# Altium schematic sheet TPSM846C23_template.SchDoc
size B; Organization: Altium Limited; Address1: L3, 12a Rodborough Rd; Address2: Frenchs Forest; Address3: NSW; Address4: Australia 2086
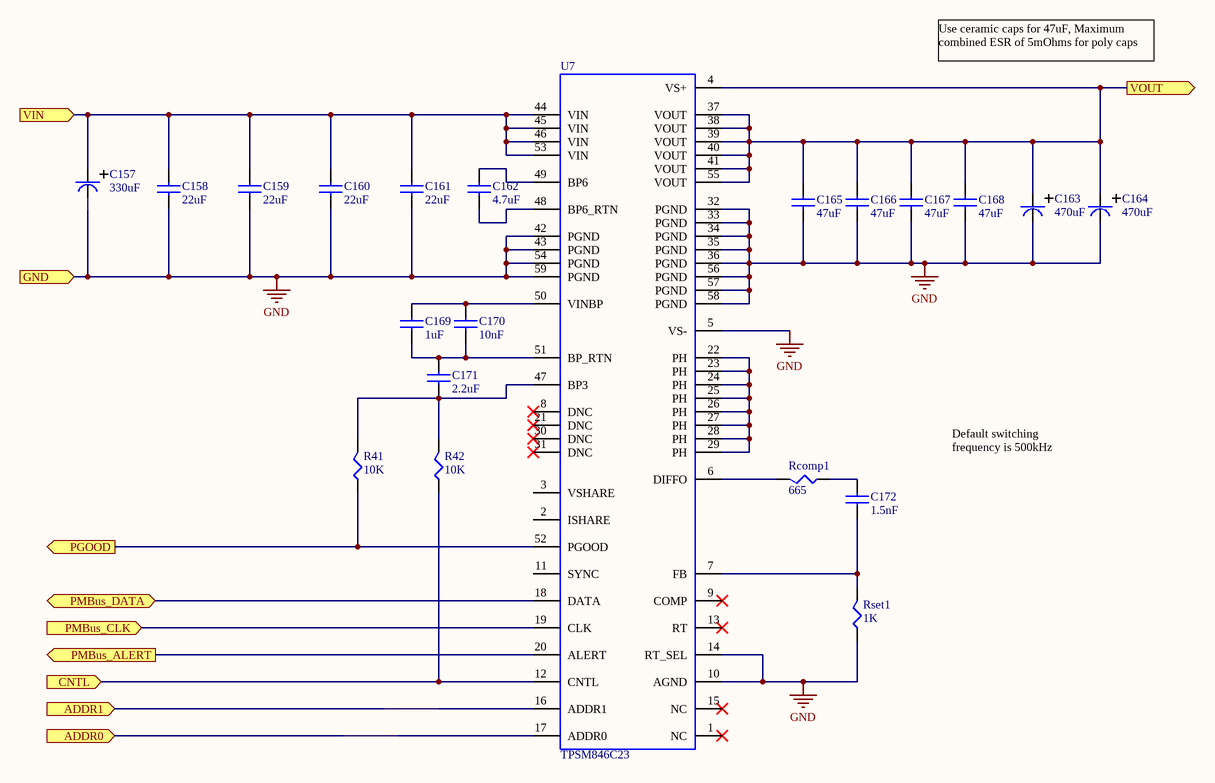
[diagram p0: TPSM846C23_template.SchDoc]

## Parts
C157  Capacitance: 330uF  [CAPAE110103X127M]  (hidden comment: CAP_POLY_330uF_25V)
C158  Capacitance: 22uF  [CAPC4532X28N]  (hidden comment: CAP_22uF_1812_25V)
C159  Capacitance: 22uF  [CAPC4532X28N]  (hidden comment: CAP_22uF_1812_25V)
C160  Capacitance: 22uF  [CAPC4532X28N]  (hidden comment: CAP_22uF_1812_25V)
C161  Capacitance: 22uF  [CAPC4532X28N]  (hidden comment: CAP_22uF_1812_25V)
C162  Capacitance: 4.7uF  [CAPC2012X14N]  (hidden comment: CAP_4.7uF_0805_25V)
C163  Capacitance: 470uF  [CAPAE110103X127M]  (hidden comment: CAP_POLY_470uF_16V)
C164  Capacitance: 470uF  [CAPAE110103X127M]  (hidden comment: CAP_POLY_470uF_16V)
C165  Capacitance: 47uF  [CAPC2012X14N]  (hidden comment: CAP_47uF_0805_10V)
C166  Capacitance: 47uF  [CAPC2012X14N]  (hidden comment: CAP_47uF_0805_10V)
C167  Capacitance: 47uF  [CAPC2012X14N]  (hidden comment: CAP_47uF_0805_10V)
C168  Capacitance: 47uF  [CAPC2012X14N]  (hidden comment: CAP_47uF_0805_10V)
C169  Capacitance: 1uF  [CAPC2012X14N]  (hidden comment: CAP_1uF_0805_25V)
C170  Capacitance: 10nF  [CAPC1005X06N]  (hidden comment: CAP_10nF_0402_25V)
C171  Capacitance: 2.2uF  [CAPC1005X06N]  (hidden comment: CAP_2.2uF_0402_25V)
C172  Capacitance: 1.5nF  [CAPC0603X02N]  (hidden comment: CAP_1500pF_0201_25V)
R41  Resistance: 10K  [RESC1608X06N]  (hidden comment: RES_10K_0603)
R42  Resistance: 10K  [RESC1608X06N]  (hidden comment: RES_10K_0603)
Rcomp1  Resistance: 665  [RESC1608X06N]  (hidden comment: RES_665_0603)
Rset1  Resistance: 1K  [RESC1608X06N]  (hidden comment: RES_1K_0603)
U7  TPSM846C23  [QFM-59]

## Ports
ADDR0 (in), ADDR1 (in), CNTL (in), GND (in), PGOOD (out), PMBus_ALERT (out), PMBus_CLK (in), PMBus_DATA (bidir), VIN (in), VOUT (out)

## Nets
GND: C157.2 C158.2 C159.2 C160.2 C161.2 C163.2 C164.2 C165.2 C166.2 C167.2 C168.2 Rset1.2 U7.5(VS-) U7.10(AGND) U7.14(RT_SEL) U7.32(PGND) U7.33(PGND) U7.34(PGND) U7.35(PGND) U7.36(PGND) U7.42(PGND) U7.43(PGND) U7.54(PGND) U7.56(PGND) U7.57(PGND) U7.58(PGND) U7.59(PGND) ; port GND
ADDR0: U7.17(ADDR0) ; port ADDR0
ADDR1: U7.16(ADDR1) ; port ADDR1
CNTL: R42.2 U7.12(CNTL) ; port CNTL
PGOOD: R41.2 U7.52(PGOOD) ; port PGOOD
PMBus_ALERT: U7.20(ALERT) ; port PMBus_ALERT
PMBus_CLK: U7.19(CLK) ; port PMBus_CLK
PMBus_DATA: U7.18(DATA) ; port PMBus_DATA
VIN: C157.1 C158.1 C159.1 C160.1 C161.1 U7.44(VIN) U7.45(VIN) U7.46(VIN) U7.53(VIN) ; port VIN
VOUT: C163.1 C164.1 C165.1 C166.1 C167.1 C168.1 U7.4(VS+) U7.37(VOUT) U7.38(VOUT) U7.39(VOUT) U7.40(VOUT) U7.41(VOUT) U7.55(VOUT) ; port VOUT
NetC162_1: C162.1 U7.49(BP6)
NetC162_2: C162.2 U7.48(BP6_RTN)
NetC169_1: C169.1 C170.1 U7.50(VINBP)
NetC169_2: C169.2 C170.2 C171.1 U7.51(BP_RTN)
NetC171_2: C171.2 R41.1 R42.1 U7.47(BP3)
NetC172_1: C172.1 Rcomp1.2
NetC172_2: C172.2 Rset1.1 U7.7(FB)
NetRcomp1_1: Rcomp1.1 U7.6(DIFFO)
NetU7_22: U7.22(PH) U7.23(PH) U7.24(PH) U7.25(PH) U7.26(PH) U7.27(PH) U7.28(PH) U7.29(PH)

Not connected (* = marked no-connect by the designer): U7 1(NC)* 2(ISHARE) 3(VSHARE) 8(DNC)* 9(COMP)* 11(SYNC) 13(RT)* 15(NC)* 21(DNC)* 30(DNC)* 31(DNC)*

## Notes on the sheet
- Use ceramic caps for 47uF, Maximum combined ESR of 5mOhms for poly caps
- Default switching frequency is 500kHz
- Title
- Size:
- Date:
- B
- Number:
- Time:
- Revision:
- Sheet
- of
- File:

## Library data of the parts
C157 = CAP_POLY_330uF_25V: SML-D12U1WT86TR-ND; Manufacturer: Panasonic; Manufacturer Part Number: 25SVF330M; Supplier 1: Digi-Key; Stock 1: 639; Pricing 1: 1=2.78, 10=2.247, 100=1.716 (USD); Supplier Part Number 1: P122120CT-ND
C158-C161 = CAP_22uF_1812_25V: CAP CER 22UF 25V X7R 1812; Manufacturer: TDK; Manufacturer Part Number: C4532X7R1E226M250KC; Dielectric Material: Ceramic; Tolerance: 20%; ComponentLink1URL: http://search.murata.co.jp/Ceramy/image/img/A01X/G101/ENG/GRM0335C1E120JA01-01.pdf; ComponentLink1Description: http://search.murata.co.jp/Ceramy/image/img/A01X/G101/ENG/GRM0335C1E120JA01-01.pdf; ComponentLink2URL: http://search.murata.co.jp/Ceramy/image/img/A01X/partnumbering_e_01.pdf; ComponentLink2Description: http://search.murata.co.jp/Ceramy/image/img/A01X/partnumbering_e_01.pdf; ComponentLink3URL: http://www1.futureelectronics.com/doc/SAMSUNG/CL03A104KQ3NNNC.pdf; ComponentLink3Description: http://www1.futureelectronics.com/doc/SAMSUNG/CL03A104KQ3NNNC.pdf; ComponentLink4URL: https://www.distrelec.biz/Web/Downloads/_e/ng/MLCC_CatalogDownload2013_ENG.pdf?mime=application%2Fpdf; ComponentLink4Description: https://www.distrelec.biz/Web/Downloads/_e/ng/MLCC_CatalogDownload2013_ENG.pdf?mime=application%2Fpdf; ComponentLink5URL: https://www.verical.com/server-webapp/html/getDatasheet?partID=355266; ComponentLink5Description: https://www.verical.com/server-webapp/html/getDatasheet?partID=355266; Supplier 1: Digi-Key; Stock 1: 5000; Pricing 1: 1=1.29, 10=0.981, 100=0.7019 (USD); Mount: Surface Mount; Case/Package: 1812; Number of Pins: 2; Weight: 0.000952oz; Case Code (Metric): 4532; Case Code (Imperial): 1812; Min Operating Temperature: -55°C; Max Operating Temperature: 125°C; Packaging: Tape and Reel; Package Quantity: 1; Termination: SMD/SMT; Voltage Rating: 25V; Voltage Rating (DC): 25V; Dielectric: X7R; Composition: Ceramic; Voltage: 25V; Length: 4.5mm; Height: 2.5mm; Width: 0.126inch; Thickness: 0.11inch; Depth: 3.2mm; Radiation Hardening: No; REACH SVHC: No SVHC; Lead Free: Lead Free; ComponentLink6URL: http://uk.rs-online.com/webdocs/1532/0900766b81532cd0.pdf; ComponentLink6Description: http://uk.rs-online.com/webdocs/1532/0900766b81532cd0.pdf; ComponentLink7URL: http://www.farnell.com/datasheets/1796654.pdf; ComponentLink7Description: http://www.farnell.com/datasheets/1796654.pdf; ComponentLink8URL: https://product.tdk.com/info/en/documents/chara_sheet/C4532X7R1E226M250KC.pdf; ComponentLink8Description: https://product.tdk.com/info/en/documents/chara_sheet/C4532X7R1E226M250KC.pdf; ComponentLink9URL: http://www.mouser.com/ds/2/400/lcc_commercial_general_en-837201.pdf; ComponentLink9Description: http://www.mouser.com/ds/2/400/lcc_commercial_general_en-837201.pdf; Supplier Part Number 1: 445-1607-1-ND
C162 = CAP_4.7uF_0805_25V: Cap Ceramic 4.7uF 25V X5R 10% SMD 0805 85C Cardboard T/R; Manufacturer: Samsung; Manufacturer Part Number: CL21A475KACLRNC; Supplier 1: Digi-Key; Stock 1: 10785; Pricing 1: 1=0.25, 10=0.171, 100=0.0867, 500=0.05932, 1000=0.05247 (USD); Mount: Surface Mount; Case/Package: 0805; Case Code (Metric): 2012; Case Code (Imperial): 0805; Min Operating Temperature: -55°C; Max Operating Temperature: 85°C; Package Quantity: 1; Packaging: Tape and Reel; Tolerance: 10%; Voltage Rating: 25V; Dielectric: X5R; Length: 2mm; Height: 0.85mm; Width: 0.049inch; Thickness: 0.037inch; Depth: 1.25mm; Radiation Hardening: No; ComponentLink1URL: http://www.samsungsem.com/kr/support/product-search/mlcc/CL21A475KACLRNC.jsp; ComponentLink1Description: http://www.samsungsem.com/kr/support/product-search/mlcc/CL21A475KACLRNC.jsp; Supplier Part Number 1: 1276-2415-1-ND
C163 C164 = CAP_POLY_470uF_16V: CAP POLYMER 470UF 20% 16V SMD; Manufacturer: Panasonic; Manufacturer Part Number: 25SVF330M; ESR (Equivalent Series Resistance): 10mR; Ripple Current: 6.1A; Leakage Current: 1.504mA; Polarity: Polar; Life (Hours): 2000Hour; Dissipation Factor: 12%; Supplier 1: Digi-Key; Stock 1: 6872; Pricing 1: 1=2.66, 10=2.147, 100=1.6399 (USD); Mount: Surface Mount; Case/Package: Radial; Number of Pins: 12; Min Operating Temperature: -55°C; Max Operating Temperature: 105°C; Tolerance: 20%; Packaging: Tape and Reel; Voltage Rating: 16V; Voltage Rating (DC): 16V; Package Quantity: 400; Ripple Current (AC): 6.1A; Termination: SMD/SMT; Voltage: 16V; Diameter: 10mm; Length: 12.6mm; Height: 12.6mm; Height - Seated (Max): 0.5inch; Radiation Hardening: No; REACH SVHC: No SVHC; Lead Free: Lead Free; ComponentLink1URL: https://www.verical.com/server-webapp/html/getDatasheet?partID=743667; ComponentLink1Description: https://www.verical.com/server-webapp/html/getDatasheet?partID=743667; ComponentLink2URL: http://www.farnell.com/datasheets/1734359.pdf; ComponentLink2Description: http://www.farnell.com/datasheets/1734359.pdf; ComponentLink3URL: http://www.farnell.com/datasheets/2059644.pdf; ComponentLink3Description: http://www.farnell.com/datasheets/2059644.pdf; Supplier Part Number 1: P16477CT-ND
C165-C168 = CAP_47uF_0805_10V: Cap Ceramic 47uF 10V X5R 20% SMD 0805 85C Embossed T/R; Manufacturer: Murata; Manufacturer Part Number: GRM21BR61A476ME15L; Dissipation Factor: 0.035%; ComponentLink1URL: http://www.samsungsem.com/kr/support/product-search/mlcc/CL21A475KACLRNC.jsp; ComponentLink1Description: http://www.samsungsem.com/kr/support/product-search/mlcc/CL21A475KACLRNC.jsp; ComponentLink2URL: http://capacitoredge.kemet.com/capedge2/DataSheet?pn=C0805C105K3RAC7800; ComponentLink2Description: http://capacitoredge.kemet.com/capedge2/DataSheet?pn=C0805C105K3RAC7800; Supplier 1: Digi-Key; Stock 1: 30000; Pricing 1: 1=0.93, 10=0.687, 100=0.4713, 500=0.37308, 1000=0.31418 (USD); Mount: Surface Mount; Case/Package: 0805; Case Code (Metric): 2012; Case Code (Imperial): 0805; Dielectric Material: Ceramic; Min Operating Temperature: -55°C; Max Operating Temperature: 85°C; Tolerance: 20%; Packaging: Tape and Reel; Dielectric: X5R; Voltage Rating: 10V; Voltage: 10V; Termination: SMD/SMT; Voltage Rating (DC): 10V; Length: 2mm; Height: 1.25mm; Width: 0.049inch; Thickness: 0.057inch; Depth: 1.25mm; REACH SVHC: No SVHC; Lead Free: Lead Free; Supplier Part Number 1: 490-9961-1-ND
C169 = CAP_1uF_0805_25V: CAP CER 1UF 25V X7R 0805; Manufacturer: Yageo; Manufacturer Part Number: CC0805KKX7R8BB105; Tolerance: 10%; Dissipation Factor: 5%; ComponentLink1URL: http://www.samsungsem.com/kr/support/product-search/mlcc/CL21A475KACLRNC.jsp; ComponentLink1Description: http://www.samsungsem.com/kr/support/product-search/mlcc/CL21A475KACLRNC.jsp; Supplier 1: Digi-Key; Stock 1: 30000; Pricing 1: 1=0.33, 10=0.226, 100=0.1145, 500=0.07832, 1000=0.06928 (USD); Mount: Surface Mount; Case/Package: 0805; Min Operating Temperature: -55°C; Max Operating Temperature: 125°C; Packaging: Tape and Reel; Dielectric: X7R; Termination: SMD/SMT; Length: 2mm; Radiation Hardening: No; ComponentLink2URL: http://capacitoredge.kemet.com/capedge2/DataSheet?pn=C0805C105K3RAC7800; ComponentLink2Description: http://capacitoredge.kemet.com/capedge2/DataSheet?pn=C0805C105K3RAC7800; Supplier Part Number 1: 311-1456-1-ND; Case Code (Metric): 2012; Case Code (Imperial): 0805; Package Quantity: 3000; Voltage Rating: 25V; Voltage Rating (DC): 25V; Width: 0.049inch; Thickness: 0.057inch; REACH SVHC: No SVHC; Number of Pins: 2; Composition: Ceramic; Height: 1.25mm; Depth: 1.25mm; Lead Free: Lead Free; Halogen Free: Halogen Free; ComponentLink3URL: http://www.yageo.com/documents/recent/UPY-GPHC_X7R_6.3V-to-50V_18.pdf; ComponentLink3Description: http://www.yageo.com/documents/recent/UPY-GPHC_X7R_6.3V-to-50V_18.pdf; ComponentLink4URL: http://www.mouser.com/ds/2/447/Yageo_UPY-GP_NP0_16V-to-50V_9-358835.pdf; ComponentLink4Description: http://www.mouser.com/ds/2/447/Yageo_UPY-GP_NP0_16V-to-50V_9-358835.pdf; ComponentLink5URL: http://www.yageo.com/documents/recent/UPY-GPHC_X7R_6.3V-to-50V_8.pdf; ComponentLink5Description: http://www.yageo.com/documents/recent/UPY-GPHC_X7R_6.3V-to-50V_8.pdf; ComponentLink6URL: http://www.farnell.com/datasheets/1489800.pdf; ComponentLink6Description: http://www.farnell.com/datasheets/1489800.pdf
C170 = CAP_10nF_0402_25V: CAP CER 10000PF 50V X7R 0402; Manufacturer: Murata; Manufacturer Part Number: GCM155R71H103KA55D; Tolerance: 10%; ComponentLink1URL: http://search.murata.co.jp/Ceramy/image/img/A01X/G101/ENG/GRM0335C1E120JA01-01.pdf; ComponentLink1Description: http://search.murata.co.jp/Ceramy/image/img/A01X/G101/ENG/GRM0335C1E120JA01-01.pdf; ComponentLink2URL: http://search.murata.co.jp/Ceramy/image/img/A01X/partnumbering_e_01.pdf; ComponentLink2Description: http://search.murata.co.jp/Ceramy/image/img/A01X/partnumbering_e_01.pdf; ComponentLink3URL: http://www1.futureelectronics.com/doc/SAMSUNG/CL03A104KQ3NNNC.pdf; ComponentLink3Description: http://www1.futureelectronics.com/doc/SAMSUNG/CL03A104KQ3NNNC.pdf; ComponentLink4URL: https://www.distrelec.biz/Web/Downloads/_e/ng/MLCC_CatalogDownload2013_ENG.pdf?mime=application%2Fpdf; ComponentLink4Description: https://www.distrelec.biz/Web/Downloads/_e/ng/MLCC_CatalogDownload2013_ENG.pdf?mime=application%2Fpdf; ComponentLink5URL: https://www.verical.com/server-webapp/html/getDatasheet?partID=355266; ComponentLink5Description: https://www.verical.com/server-webapp/html/getDatasheet?partID=355266; Supplier 1: Digi-Key; Stock 1: 100000; Pricing 1: 1=0.1, 10=0.048, 100=0.0215, 500=0.01538, 1000=0.01208, 2500=0.01098, 5000=0.0101 (USD); Mount: Surface Mount; Case/Package: 0402; Case Code (Imperial): 0402; Case Code (Metric): 1005; Min Operating Temperature: -55°C; Max Operating Temperature: 125°C; Voltage Rating: 50V; Packaging: Tape and Reel; Package Quantity: 1; Dielectric: X7R; Termination: SMD/SMT; Voltage: 50V; Voltage Rating (DC): 50V; Length: 1mm; Height: 0.5mm; Width: 0.02inch; Thickness: 0.022inch; Depth: 0.5mm; Ratings: AEC-Q200; Radiation Hardening: No; REACH SVHC: No SVHC; Lead Free: Lead Free; ComponentLink6URL: http://psearch.murata.com/capacitor/product/GCM155R71H103KA55%23.pdf; ComponentLink6Description: http://psearch.murata.com/capacitor/product/GCM155R71H103KA55%23.pdf; ComponentLink7URL: https://www.verical.com/server-webapp/html/getDatasheet?partID=27433; ComponentLink7Description: https://www.verical.com/server-webapp/html/getDatasheet?partID=27433; ComponentLink8URL: http://psearch.en.murata.com/capacitor/product/GCM155R71H103KA55%23.pdf; ComponentLink8Description: http://psearch.en.murata.com/capacitor/product/GCM155R71H103KA55%23.pdf; ComponentLink9URL: http://search.murata.co.jp/Ceramy/image/img/A01X/partnumbering_e_02.pdf; ComponentLink9Description: http://search.murata.co.jp/Ceramy/image/img/A01X/partnumbering_e_02.pdf; ComponentLink10URL: http://uk.rs-online.com/webdocs/0ef9/0900766b80ef92d0.pdf; ComponentLink10Description: http://uk.rs-online.com/webdocs/0ef9/0900766b80ef92d0.pdf; Supplier Part Number 1: 490-4762-1-ND
C171 = CAP_2.2uF_0402_25V: Multilayer Ceramic Capacitors MLCC - SMD/SMT 0402 2.2uF 25volts *Derate Voltage/Temp; Manufacturer: Murata; Manufacturer Part Number: GRM155R61E225ME15D; Voltage Rating: 25V; Tolerance: 20%; Dielectric: X5R; ComponentLink1URL: http://search.murata.co.jp/Ceramy/image/img/A01X/G101/ENG/GRM0335C1E120JA01-01.pdf; ComponentLink1Description: http://search.murata.co.jp/Ceramy/image/img/A01X/G101/ENG/GRM0335C1E120JA01-01.pdf; ComponentLink2URL: http://search.murata.co.jp/Ceramy/image/img/A01X/partnumbering_e_01.pdf; ComponentLink2Description: http://search.murata.co.jp/Ceramy/image/img/A01X/partnumbering_e_01.pdf; ComponentLink3URL: http://www1.futureelectronics.com/doc/SAMSUNG/CL03A104KQ3NNNC.pdf; ComponentLink3Description: http://www1.futureelectronics.com/doc/SAMSUNG/CL03A104KQ3NNNC.pdf; ComponentLink4URL: https://www.distrelec.biz/Web/Downloads/_e/ng/MLCC_CatalogDownload2013_ENG.pdf?mime=application%2Fpdf; ComponentLink4Description: https://www.distrelec.biz/Web/Downloads/_e/ng/MLCC_CatalogDownload2013_ENG.pdf?mime=application%2Fpdf; ComponentLink5URL: https://www.verical.com/server-webapp/html/getDatasheet?partID=355266; ComponentLink5Description: https://www.verical.com/server-webapp/html/getDatasheet?partID=355266; ComponentLink6URL: http://psearch.murata.com/capacitor/product/GCM155R71H103KA55%23.pdf; ComponentLink6Description: http://psearch.murata.com/capacitor/product/GCM155R71H103KA55%23.pdf; ComponentLink7URL: https://www.verical.com/server-webapp/html/getDatasheet?partID=27433; ComponentLink7Description: https://www.verical.com/server-webapp/html/getDatasheet?partID=27433; ComponentLink8URL: http://psearch.en.murata.com/capacitor/product/GCM155R71H103KA55%23.pdf; ComponentLink8Description: http://psearch.en.murata.com/capacitor/product/GCM155R71H103KA55%23.pdf; ComponentLink9URL: http://search.murata.co.jp/Ceramy/image/img/A01X/partnumbering_e_02.pdf; ComponentLink9Description: http://search.murata.co.jp/Ceramy/image/img/A01X/partnumbering_e_02.pdf; ComponentLink10URL: http://uk.rs-online.com/webdocs/0ef9/0900766b80ef92d0.pdf; ComponentLink10Description: http://uk.rs-online.com/webdocs/0ef9/0900766b80ef92d0.pdf; Supplier 1: Digi-Key; Stock 1: 100000; Pricing 1: 1=0.34, 10=0.23, 100=0.1163, 500=0.0796, 1000=0.07041, 2500=0.06735, 5000=0.06123 (USD); Mount: Surface Mount; Case/Package: 0402; Weight: 0.000212oz; Case Code (Metric): 1005; Case Code (Imperial): 0402; Min Operating Temperature: -55°C; Max Operating Temperature: 85°C; Packaging: Tape and Reel; Termination: SMD/SMT; Voltage Rating (DC): 25V; Package Quantity: 10000; Length: 0.039inch; Height: 0.5mm; Width: 0.02inch; Thickness: 0.022inch; Supplier Part Number 1: 490-10457-1-ND
C172 = CAP_1500pF_0201_25V: Multilayer Ceramic Capacitors MLCC - SMD/SMT 0.0015uF 25Volts 10%; Manufacturer: Murata; Manufacturer Part Number: GCM033R71E152KA03D; Voltage Rating: 25V; Dielectric: X7R; ComponentLink1URL: http://search.murata.co.jp/Ceramy/image/img/A01X/G101/ENG/GRM0335C1E120JA01-01.pdf; ComponentLink1Description: http://search.murata.co.jp/Ceramy/image/img/A01X/G101/ENG/GRM0335C1E120JA01-01.pdf; ComponentLink2URL: http://search.murata.co.jp/Ceramy/image/img/A01X/partnumbering_e_01.pdf; ComponentLink2Description: http://search.murata.co.jp/Ceramy/image/img/A01X/partnumbering_e_01.pdf; Supplier 1: Digi-Key; Stock 1: 27534; Pricing 1: 1=0.1, 10=0.048, 100=0.0216, 500=0.01542, 1000=0.01211, 2500=0.01101, 5000=0.01013 (USD); Mount: Surface Mount; Case/Package: 0201; Case Code (Metric): 0603; Case Code (Imperial): 0201; Min Operating Temperature: -55°C; Max Operating Temperature: 125°C; Package Quantity: 15000; Packaging: Tape and Reel; Tolerance: 10%; Voltage Rating (DC): 25V; Termination: SMD/SMT; Length: 0.6mm; Height: 0.3mm; Width: 0.012inch; Thickness: 0.013inch; Depth: 0.3mm; Ratings: AEC-Q200; Radiation Hardening: No; ComponentLink3URL: http://search.murata.co.jp/Ceramy/image/img/A01X/partnumbering_e_02.pdf; ComponentLink3Description: http://search.murata.co.jp/Ceramy/image/img/A01X/partnumbering_e_02.pdf; ComponentLink4URL: http://psearch.murata.com/capacitor/product/GCM033R71E152KA03%23.pdf; ComponentLink4Description: http://psearch.murata.com/capacitor/product/GCM033R71E152KA03%23.pdf; ComponentLink5URL: https://www.murata.com/~/media/webrenewal/support/library/catalog/products/capacitor/mlcc/c03e.ashx?la=en-us; ComponentLink5Description: https://www.murata.com/~/media/webrenewal/support/library/catalog/products/capacitor/mlcc/c03e.ashx?la=en-us; Supplier Part Number 1: 490-7996-1-ND
R41 R42 = RES_10K_0603: RES SMD 10K OHM 1% 1/4W 0603; Manufacturer: Rohm; Manufacturer Part Number: ESR03EZPF1002; Power Rating: 250mW; Temperature Coefficient: 100ppm/°C; Supplier 1: Digi-Key; Stock 1: 273579; Pricing 1: 1=0.14, 10=0.126, 100=0.0484, 1000=0.0213, 2500=0.01839 (USD); Case/Package: 0603; Case Code (Metric): 1608; Case Code (Imperial): 0603; Min Operating Temperature: -55°C; Max Operating Temperature: 155°C; Tolerance: 1%; Package Quantity: 1; Packaging: Tape and Reel; Composition: Thick Film; Number of Terminations: 2; Max Power Dissipation: 250mW; Features: Automotive AEC-Q200; Length: 0.063inch; Height: 0.022inch; Width: 0.031inch; Lead Free: Lead Free; ComponentLink1URL: https://www.rohm.com/datasheet/ESR01MZPF/esr-e; ComponentLink1Description: https://www.rohm.com/datasheet/ESR01MZPF/esr-e; Supplier Part Number 1: P10.0KHCT-ND
Rcomp1 = RES_665_0603: RESISTOR, 665R, 0603, 0.1%, 0.1W; Manufacturer: Panasonic; Manufacturer Part Number: ERA3AEB6650V; Power Rating: 100mW; Voltage Rating: 75V; Temperature Coefficient: 25ppm/°C; ComponentLink1URL: https://www.rohm.com/datasheet/ESR01MZPF/esr-e; ComponentLink1Description: https://www.rohm.com/datasheet/ESR01MZPF/esr-e; Supplier 1: Digi-Key; Stock 1: 9157; Pricing 1: 1=0.35, 10=0.3, 100=0.1172, 1000=0.04906, 2500=0.04498 (USD); Mount: Surface Mount; Case/Package: 0603; Number of Pins: 2; Case Code (Imperial): 0603; Case Code (Metric): 1608; Contact Plating: Tin; Min Operating Temperature: -55°C; Max Operating Temperature: 155°C; Tolerance: 0.1%; Packaging: Tape and Reel; Package Quantity: 1; Composition: Metal Film,Thin Film; Number of Terminations: 2; Max Power Dissipation: 100mW; Voltage Rating (DC): 75V; Features: Automotive AEC-Q200; Military Standard: Not; Length: 1.6mm; Height: 0.45mm; Width: 0.8mm; Depth: 0.8mm; Radiation Hardening: No; Lead Free: Lead Free; ComponentLink2URL: http://www.farnell.com/datasheets/485442.pdf; ComponentLink2Description: http://www.farnell.com/datasheets/485442.pdf; ComponentLink3URL: http://industrial.panasonic.com/www-data/pdf/AOA0000/AOA0000CE26.pdf; ComponentLink3Description: http://industrial.panasonic.com/www-data/pdf/AOA0000/AOA0000CE26.pdf; ComponentLink4URL: http://uk.rs-online.com/webdocs/0eb1/0900766b80eb1d8c.pdf; ComponentLink4Description: http://uk.rs-online.com/webdocs/0eb1/0900766b80eb1d8c.pdf; Supplier Part Number 1: P665DBCT-ND
Rset1 = RES_1K_0603: RES SMD 1K OHM 5% 1/4W 0603; Manufacturer: Rohm; Manufacturer Part Number: ESR03EZPJ102; Temperature Coefficient: 200ppm/°C; Max Power Dissipation: 250mW; ComponentLink1URL: https://www.rohm.com/datasheet/ESR01MZPF/esr-e; ComponentLink1Description: https://www.rohm.com/datasheet/ESR01MZPF/esr-e; Supplier 1: Digi-Key; Stock 1: 381742; Pricing 1: 1=0.1, 10=0.087, 100=0.0333, 1000=0.01464, 2500=0.01264 (USD); Case/Package: 0603; Case Code (Metric): 1608; Case Code (Imperial): 0603; Min Operating Temperature: -55°C; Max Operating Temperature: 155°C; Tolerance: 5%; Package Quantity: 1; Packaging: Tape and Reel; Composition: Thick Film; Number of Terminations: 2; Features: Automotive AEC-Q200; Length: 0.063inch; Height: 0.022inch; Width: 0.031inch; Lead Free: Lead Free; Supplier Part Number 1: RHM1.0KDCT-ND
U7 = TPSM846C23: Non-Isolated PoL Module DC DC Converter 1 Output 0.35 ~ 2V 35A 4.5V - 15V Input; Manufacturer: Texas Instruments; Manufacturer Part Number: TPSM846C23MOLR; Supplier 1: Digi-Key; Stock 1: 323; Pricing 1: 1=24.49, 10=22.587, 100=19.2882 (USD); Min Operating Temperature: -40°C; Max Operating Temperature: 105°C; Supplier Part Number 1: 296-48350-1-ND